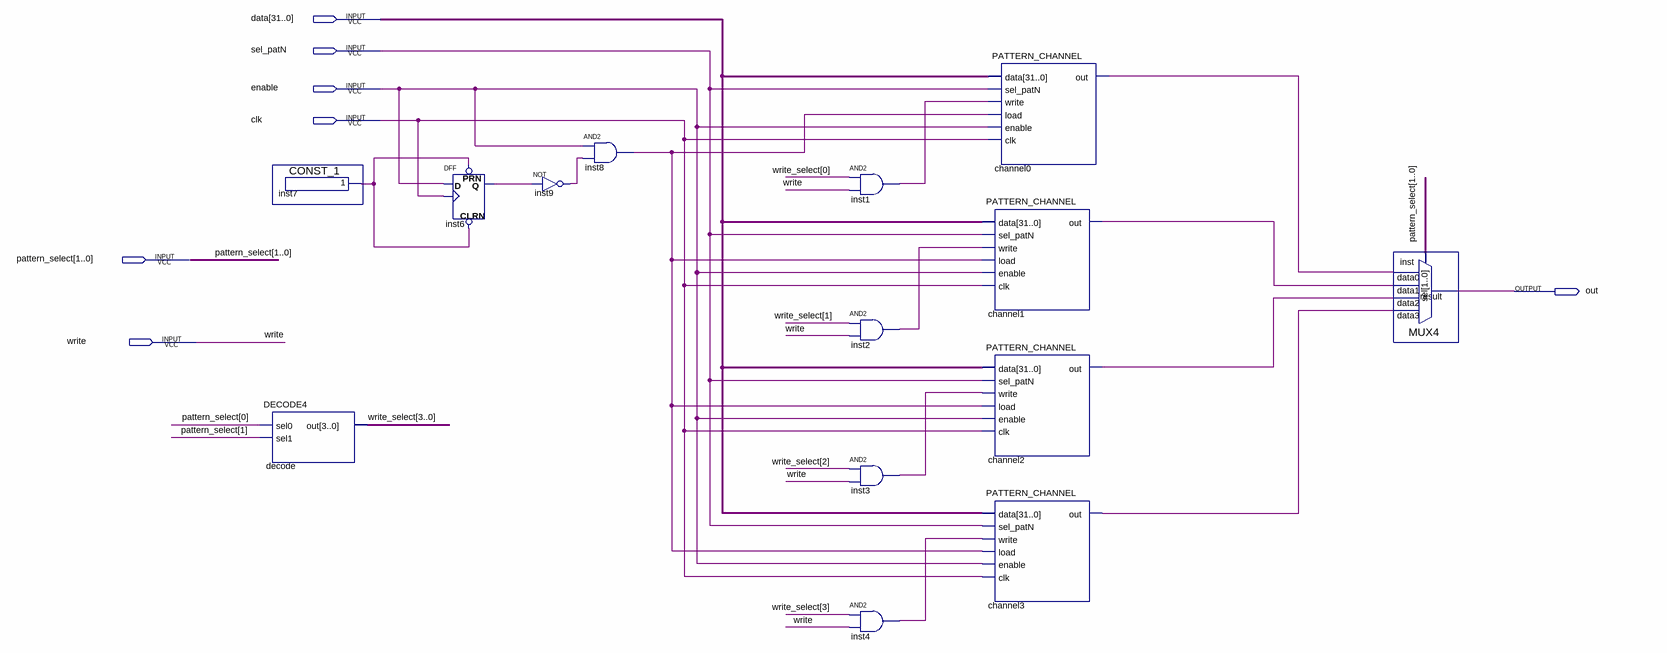
[diagram p0: schematic sheet]
// Quartus schematic CHANNEL.bdf as structural Verilog: 14 symbols, 7 pins
module CHANNEL (
  input  [31:0] data,
  input  sel_patN,
  input  enable,
  input  clk,
  input  [1:0] pattern_select,
  input  write,
  output out
);

  wire channel0_out, channel1_out, channel2_out, channel3_out, inst1_out, inst2_out, inst3_out, inst4_out,
       inst6_q, inst7_result, inst8_out, inst9_out;
  wire [3:0] write_select;

  CONST_1 inst7 (.result(inst7_result));
  DECODE4 decode (.sel0(pattern_select[0]), .sel1(pattern_select[1]), .out(write_select));
  DFF inst6 (.CLRN(inst7_result), .CLK(clk), .D(enable), .PRN(inst7_result), .Q(inst6_q));
  not inst9 (inst9_out, inst6_q);
  and inst8 (inst8_out, enable, inst9_out);
  and inst1 (inst1_out, write_select[0], write);
  and inst2 (inst2_out, write_select[1], write);
  and inst3 (inst3_out, write_select[2], write);
  and inst4 (inst4_out, write_select[3], write);
  PATTERN_CHANNEL channel1 (
    .data(data), .sel_patN(sel_patN), .write(inst2_out), .load(inst8_out), .enable(enable), .clk(clk),
    .out(channel1_out));
  PATTERN_CHANNEL channel2 (
    .data(data), .sel_patN(sel_patN), .write(inst3_out), .load(inst8_out), .enable(enable), .clk(clk),
    .out(channel2_out));
  PATTERN_CHANNEL channel3 (
    .data(data), .sel_patN(sel_patN), .write(inst4_out), .load(inst8_out), .enable(enable), .clk(clk),
    .out(channel3_out));
  PATTERN_CHANNEL channel0 (
    .data(data), .sel_patN(sel_patN), .write(inst1_out), .load(inst8_out), .enable(enable), .clk(clk),
    .out(channel0_out));
  MUX4 inst (
    .data3(channel3_out), .data2(channel2_out), .data1(channel1_out), .data0(channel0_out),
    .sel(pattern_select), .result(out));
endmodule
